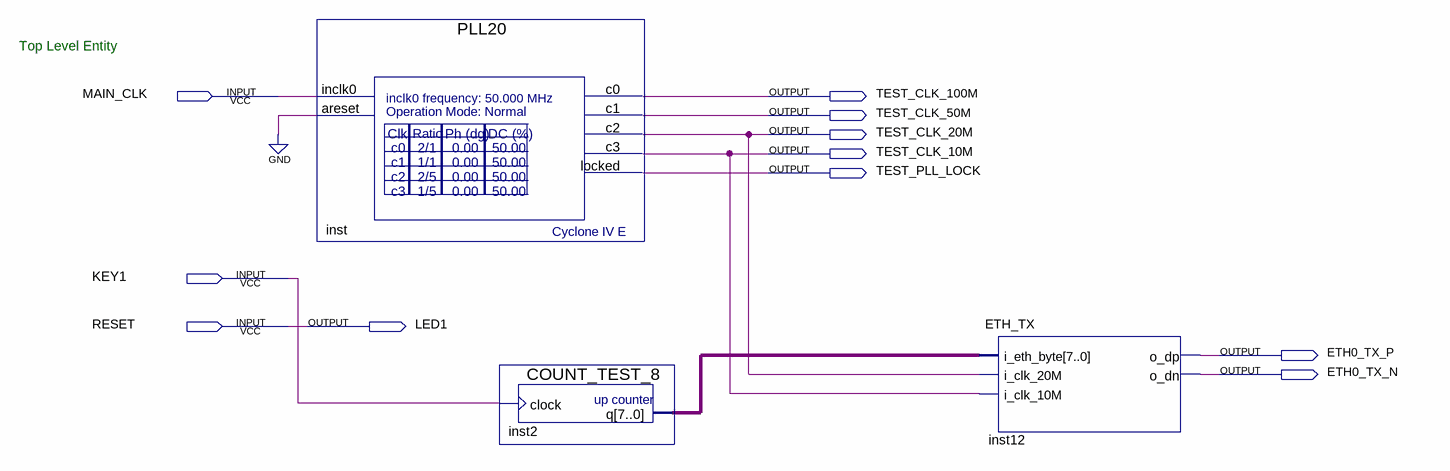
[diagram p0: schematic sheet]
// Quartus schematic FPGACode.bdf as structural Verilog: 3 symbols, 11 pins
module FPGACode (
  input  MAIN_CLK,
  input  KEY1,
  input  RESET,
  output TEST_CLK_100M,
  output TEST_CLK_50M,
  output TEST_CLK_20M,
  output TEST_CLK_10M,
  output TEST_PLL_LOCK,
  output LED1,
  output ETH0_TX_P,
  output ETH0_TX_N
);

  wire [7:0] inst2_q;

  PLL20 inst (
    .inclk0(MAIN_CLK), .areset(1'b0), .c0(TEST_CLK_100M), .c1(TEST_CLK_50M), .c2(TEST_CLK_20M),
    .c3(TEST_CLK_10M), .locked(TEST_PLL_LOCK));
  COUNT_TEST_8 inst2 (.clock(KEY1), .q(inst2_q));
  ETH_TX inst12 (
    .i_eth_byte(inst2_q), .i_clk_20M(TEST_CLK_20M), .i_clk_10M(TEST_CLK_10M), .o_dp(ETH0_TX_P),
    .o_dn(ETH0_TX_N));

  assign LED1 = RESET;

  // Notes on the sheet:
  //   Top Level Entity
endmodule
